# EAGLE design TCC (EAGLE 7.5.0)
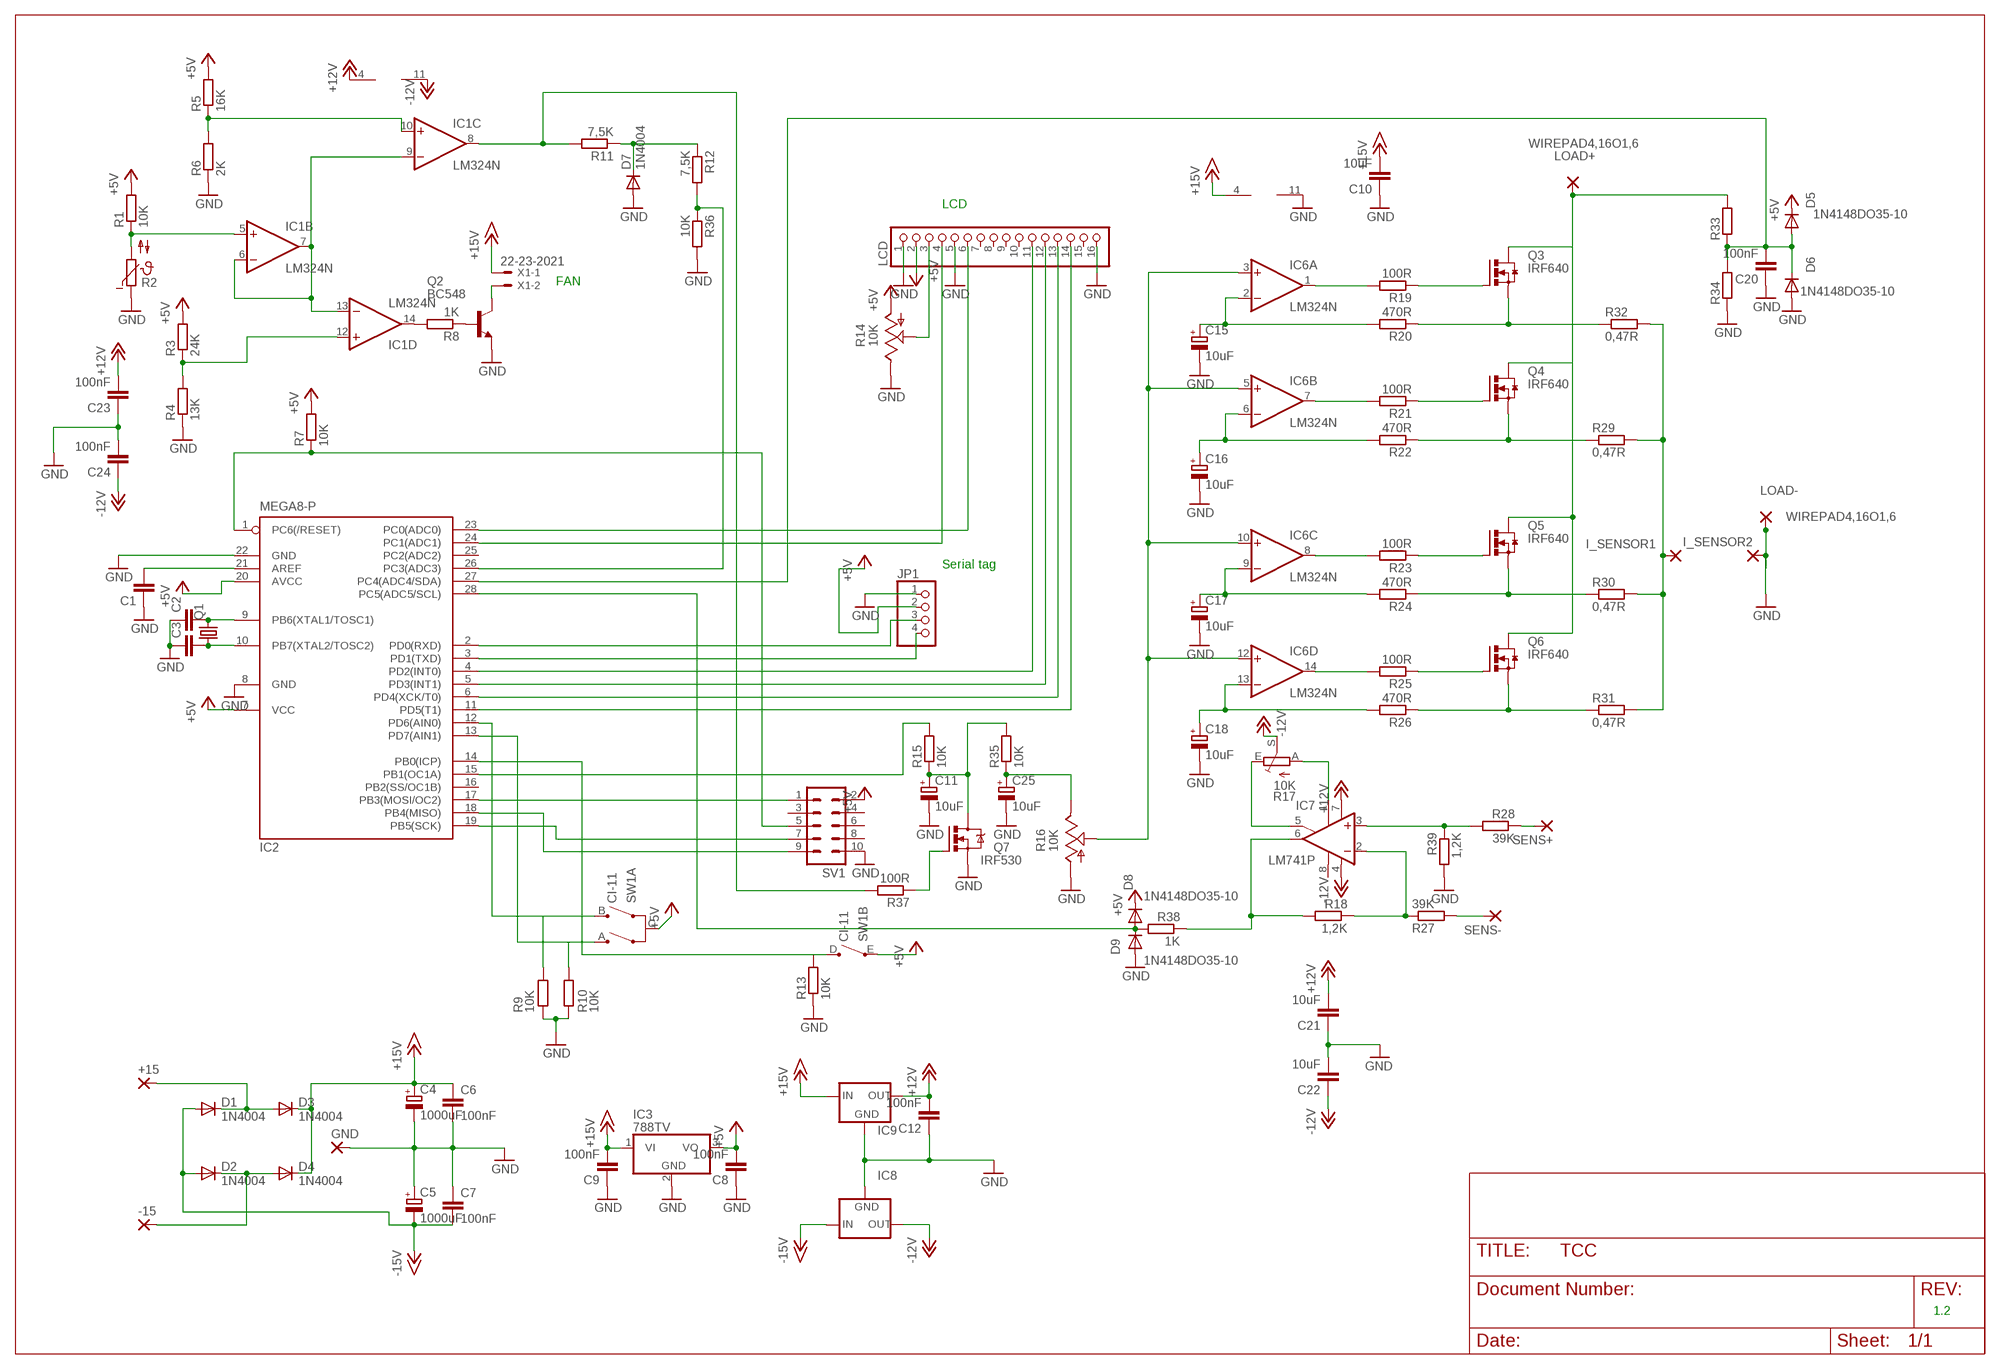
[diagram p0: schematic, sheet 1]

## Parts
+15  2,54/0,9  [2,54/0,9]
-15  2,54/0,9  [2,54/0,9]
C1  C5/2.5  [C5B2.5]
C2  C5/2.5  [C5B2.5]
C3  C5/2.5  [C5B2.5]
C4  1000uF  CPOL-EUE3.5-10  [E3,5-10]
C5  1000uF  CPOL-EUE3.5-10  [E3,5-10]
C6  100nF  C-EU050-025X075  [C050-025X075]
C7  100nF  C-EU050-025X075  [C050-025X075]
C8  100nF  C5/2.5  [C5B2.5]
C9  100nF  C5/2.5  [C5B2.5]
C10  10uF  C5/2.5  [C5B2.5]
C11  10uF  CPOL-EUE2,5-6E  [E2,5-6E]
C12  100nF  C5/2.5  [C5B2.5]
C15  10uF  CPOL-EUE2,5-6E  [E2,5-6E]
C16  10uF  CPOL-EUE2,5-6E  [E2,5-6E]
C17  10uF  CPOL-EUE2,5-6E  [E2,5-6E]
C18  10uF  CPOL-EUE2,5-6E  [E2,5-6E]
C20  100nF  C5/2.5  [C5B2.5]
C21  10uF  C5/2.5  [C5B2.5]
C22  10uF  C5/2.5  [C5B2.5]
C23  100nF  C5/2.5  [C5B2.5]
C24  100nF  C5/2.5  [C5B2.5]
C25  10uF  CPOL-EUE2,5-6E  [E2,5-6E]
D1  1N4004  [DO41-10]
D2  1N4004  [DO41-10]
D3  1N4004  [DO41-10]
D4  1N4004  [DO41-10]
D5  1N4148DO35-10  [DO35-10]
D6  1N4148DO35-10  [DO35-10]
D7  1N4004  [DO41-10]
D8  1N4148DO35-10  [DO35-10]
D9  1N4148DO35-10  [DO35-10]
GND  2,54/0,9  [2,54/0,9]
I_SENSOR1  3,17/1,3  [3,17/1,3]
I_SENSOR2  3,17/1,3  [3,17/1,3]
IC1  LM324N  [DIL14]
IC2  MEGA8-P  [DIL28-3]
IC3  788TV  [TO220V]
IC6  LM324N  [DIL14]
IC7  LM741P  [DIL08]
IC8  79XXS  [79XXS]
IC9  78XXS  [78XXS]
JP1  PINHD-1X4  [1X04]
LCD  PINHD-1X16  [1X16]
LOAD+  WIREPAD4,16O1,6  [4,16O1,6]
LOAD-  WIREPAD4,16O1,6  [4,16O1,6]
Q1  CRYSTALHC49S  [HC49/S]
Q2  BC548  [TO92-EBC]
Q3  IRF640  IRFI540NPBF  [TO220BH]
Q4  IRF640  IRFI540NPBF  [TO220BH]
Q5  IRF640  IRFI540NPBF  [TO220BH]
Q6  IRF640  IRFI540NPBF  [TO220BH]
Q7  IRF530  [TO220BV]
R1  10K  R-EU_0207/12  [0207/12]
R2  NTC640  [P640]
R3  24K  R-EU_0207/10  [0207/10]
R4  13K  R-EU_0204/7  [0204/7]
R5  16K  R-EU_0204/7  [0204/7]
R6  2K  R-EU_0204/7  [0204/7]
R7  10K  R-EU_0204/7  [0204/7]
R8  1K  R-EU_0204/7  [0204/7]
R9  10K  R-EU_0204/7  [0204/7]
R10  10K  R-EU_0204/7  [0204/7]
R11  7,5K  R-EU_0204/7  [0204/7]
R12  7,5K  R-EU_0204/7  [0204/7]
R13  10K  R-EU_0207/10  [0207/10]
R14  10K  TRIM_US-LI10  [LI10@1]
R15  10K  R-EU_0204/7  [0204/7]
R16  10K  TRIM_US-S64W  [S64W]
R17  10K  TRIM_EU-LI10  [LI10]
R18  1,2K  R-EU_0207/10  [0207/10]
R19  100R  R-EU_0207/10  [0207/10]
R20  470R  R-EU_0207/10  [0207/10]
R21  100R  R-EU_0207/15  [0207/15]
R22  470R  R-EU_0207/12  [0207/12]
R23  100R  R-EU_0207/15  [0207/15]
R24  470R  R-EU_0207/10  [0207/10]
R25  100R  R-EU_0207/10  [0207/10]
R26  470R  R-EU_0207/10  [0207/10]
R27  39K  R-EU_0207/10  [0207/10]
R28  39K  R-EU_0204/7  [0204/7]
R29  0,47R  R-EU_VTA56  [VTA56]
R30  0,47R  R-EU_VTA56  [VTA56]
R31  0,47R  R-EU_VTA56  [VTA56]
R32  0,47R  R-EU_VTA56  [VTA56]
R33  R-EU_0207/15  [0207/15]
R34  R-EU_0207/10  [0207/10]
R35  10K  R-EU_0204/7  [0204/7]
R36  10K  R-EU_0204/7  [0204/7]
R37  100R  R-EU_0204/7  [0204/7]
R38  1K  R-EU_0207/10  [0207/10]
R39  1,2K  R-EU_0207/10  [0207/10]
SENS+  2,54/1,1  [2,54/1,1]
SENS-  2,54/1,1  [2,54/1,1]
SV1  ML10  [ML10]
SW1  CI-11  [CI-11]
X1  22-23-2021  [22-23-2021]

## Nets
+5V: C8.2 D5.C D8.C IC2.7(VCC) IC2.20(AVCC) IC3.3(VO) JP1.2 LCD.2 R1.2 R3.2 R5.2 R7.2 R14.A SV1.2 SW1.C(A:C) SW1.E(B:E)
+12V: C12.2 C21.2 C23.2 IC1.4(P:V+) IC7.7(V+) IC9.OUT
+15V: C4.+ C6.1 C9.2 C10.2 D3.C D4.C IC3.1(VI) IC6.4(P:V+) IC9.IN X1.1
-12V: C22.1 C24.1 IC1.11(P:V-) IC7.4(V-) IC8.OUT R17.S
-15V: C5.- C7.2 D1.A D2.A IC8.IN
GND: C1.1 C2.1 C3.1 C4.- C5.+ C6.2 C7.1 C8.1 C9.1 C10.1 C11.- C12.1 C15.- C16.- C17.- C18.- C20.1 C21.1 C22.2 C23.1 C24.2 C25.- D6.A D7.A D9.A GND.1(P) I_SENSOR2.1(P) IC2.8(GND) IC2.22(GND) IC3.2(GND) IC6.11(P:V-) IC8.GND IC9.GND JP1.1 LCD.1 LCD.5 LCD.16 LOAD-.1(P) Q2.E Q7.S R2.1 R4.1 R6.1 R9.1 R10.1 R13.1 R14.E R16.A R34.1 R36.2 R39.2 SV1.10
N$1: C2.2 IC2.9(PB6(XTAL1/TOSC1)) Q1.2
N$2: C3.2 IC2.10(PB7(XTAL2/TOSC2)) Q1.1
N$3: IC2.17(PB3(MOSI/OC2)) SV1.1
N$4: IC2.18(PB4(MISO)) SV1.9
N$5: IC2.19(PB5(SCK)) SV1.7
N$6: IC2.1(PC6(/RESET)) R7.1 SV1.5
N$7: C1.2 IC2.21(AREF)
N$8: IC1.8(C:OUT) R11.2 R37.2
N$9: IC2.24(PC1(ADC1)) LCD.4
N$10: IC2.23(PC0(ADC0)) LCD.6
N$11: IC2.4(PD2(INT0)) LCD.11
N$12: IC2.5(PD3(INT1)) LCD.12
N$13: IC2.14(PB0(ICP)) R13.2 SW1.D(B:D)
N$14: IC2.11(PD5(T1)) LCD.14
N$15: IC2.12(PD6(AIN0)) R9.2 SW1.B(A:B)
N$16: C11.+ Q7.D R15.1 R35.2
N$17: Q3.S R20.1 R32.1
N$18: Q4.S R22.1 R29.1
N$19: Q5.S R24.1 R30.1
N$20: IC2.13(PD7(AIN1)) R10.2 SW1.A(A:A)
N$21: Q6.S R26.1 R31.1
N$22: IC6.1(A:OUT) R19.2
N$23: Q3.G R19.1
N$24: IC6.7(B:OUT) R21.2
N$25: Q4.G R21.1
N$26: LOAD+.1(P) Q3.D Q4.D Q5.D Q6.D R33.2
N$27: IC6.3(A:+IN) IC6.5(B:+IN) IC6.10(C:+IN) IC6.12(D:+IN) R16.S
N$28: C15.+ IC6.2(A:-IN) R20.2
N$29: C17.+ IC6.9(C:-IN) R24.2
N$30: C16.+ IC6.6(B:-IN) R22.2
N$31: IC7.2(-IN) R18.1 R27.1
N$32: IC1.6(B:-IN) IC1.7(B:OUT) IC1.9(C:-IN) IC1.13(D:-IN)
N$33: C18.+ IC6.13(D:-IN) R26.2
N$34: D8.A D9.C IC2.28(PC5(ADC5/SCL)) R38.2
N$35: IC7.1(ON1) R17.A
N$36: C25.+ R16.E R35.1
N$37: IC2.15(PB1(OC1A)) R15.2
N$38: IC7.5(ON2) R17.E
N$39: C20.2 D5.A D6.C IC2.27(PC4(ADC4/SDA)) R33.1 R34.2
N$40: LCD.3 R14.S
N$41: IC1.5(B:+IN) R1.1 R2.2
N$42: IC1.10(C:+IN) R5.1 R6.2
N$43: IC7.3(+IN) R28.2 R39.1
N$44: Q2.B R8.1
N$45: IC2.26(PC3(ADC3)) R12.2 R36.1
N$46: Q2.C X1.2
N$47: IC1.14(D:OUT) R8.2
N$48: IC1.12(D:+IN) R3.1 R4.2
N$49: I_SENSOR1.1(P) R29.2 R30.2 R31.2 R32.2
N$50: IC2.6(PD4(XCK/T0)) LCD.13
N$51: IC6.8(C:OUT) R23.2
N$52: Q5.G R23.1
N$53: IC6.14(D:OUT) R25.2
N$54: Q6.G R25.1
N$55: Q7.G R37.1
N$56: D7.C R11.1 R12.1
N$57: +15.1(P) D1.C D3.A
N$58: -15.1(P) D2.C D4.A
N$60: IC7.6(OUT) R18.2 R38.1
N$61: R27.2 SENS-.1(P)
N$62: R28.1 SENS+.1(P)
N$63: IC2.3(PD1(TXD)) JP1.4
N$64: IC2.2(PD0(RXD)) JP1.3
Unconnected: IC1.1(A:OUT) IC1.2(A:-IN) IC1.3(A:+IN) IC2.16(PB2(SS/OC1B)) IC2.25(PC2(ADC2)) IC7.8(OPT) LCD.7 LCD.8 LCD.9 LCD.10 LCD.15 SV1.3 SV1.4 SV1.6 SV1.8

## Notes on the sheet
- LCD
- FAN
- Serial tag
- 1.2

## Library data of the parts
+15 -15 GND = wirepad:2,54/0,9: THROUGH-HOLE PAD
C1-C3 C8-C10 C12 C20-C24 = capacitor-wima:C: CAPACITOR naming: grid - package width
C4 C5 C11 C15-C18 C25 = rcl:CPOL-EU: POLARIZED CAPACITOR, European symbol
C6 C7 = rcl:C-EU: CAPACITOR, European symbol
D1-D4 D7 = diode:1N4004: DIODE general purpose rectifier, 1 A
D5 D6 D8 D9 = diode:1N4148: DIODE high speed (Philips)
I_SENSOR1 I_SENSOR2 = wirepad:3,17/1,3: THROUGH-HOLE PAD
IC1 IC6 = linear:LM324: OP AMP
IC2 = atmel:MEGA8-P: MICROCONTROLLER 8 Kbytes FLASH, 1 kbytes SRAM, 512 bytes EEPROM, USART, 4-channel 10 bit ADC, 2-channel 8 bit ADC Pin compatible with Atmega48, ATMega88, ATMega168 Source: avr.lbr; OC_FARNELL: unknown; OC_NEWARK: unknown
IC3 = linear:78*: Positive VOLTAGE REGULATOR Source: http://cache.national.com/ds/LM/LM78L05.pdf http://www.fairchildsemi.com/ds/LM/LM7805.pdf
IC7 = linear:*741: OP AMP
IC8 = v-reg:79XXS: VOLTAGE REGULATOR
IC9 = v-reg:78XXS: VOLTAGE REGULATOR
JP1 = pinhead:PINHD-1X4: PIN HEADER
LCD = pinhead:PINHD-1X16: PIN HEADER
LOAD+ LOAD- = wirepad:WIREPAD: Wire PAD connect wire on PCB
Q1 = crystal:CRYSTAL: CRYSTAL; OC_FARNELL: 1667008; OC_NEWARK: unknown
Q2 = transistor-npn:BC548*: NPN Transistor
Q3-Q6 = transistor-power:IRFI540NPBF: HEXFET Power MOISFET VDSS = 100V, RDS(on) = 0.052 Ohm, ID = 20A, VGS(th) = 2.0 -- 4.0V Source: http://www.irf.com/product-info/datasheets/data/irfi540npbf.pdf
Q7 = transistor-power:IRF530: HEXFET Power MOSFET
R1 R3-R8 R11 R12 R15 R35-R37 = resistor:R-EU_: RESISTOR, European symbol
R2 = ptc-ntc:NTC640: PHILIPS NTC; OC_FARNELL: unknown; OC_NEWARK: unknown
R9 R10 R13 R18-R34 R38 R39 = rcl:R-EU_: RESISTOR, European symbol
R14 R16 = pot:TRIM_US-: POTENTIOMETER
R17 = pot:TRIM_EU-: POTENTIOMETER
SENS+ SENS- = wirepad:2,54/1,1: THROUGH-HOLE PAD
SV1 = con-harting-ml:ML10: HARTING; OC_FARNELL: unknown; OC_NEWARK: unknown
SW1 = piher:CI-11: 11mm Incemental Encoder Source: www.piher.net .. 04-CI-11v04.pdf; OC_FARNELL: unknown; OC_NEWARK: unknown
X1 = con-molex:22-23-2021: .100" (2.54mm) Center Header - 2 Pin; MF: MOLEX; MPN: 22-23-2021; OC_FARNELL: 1462926; OC_NEWARK: 25C3832

## Board
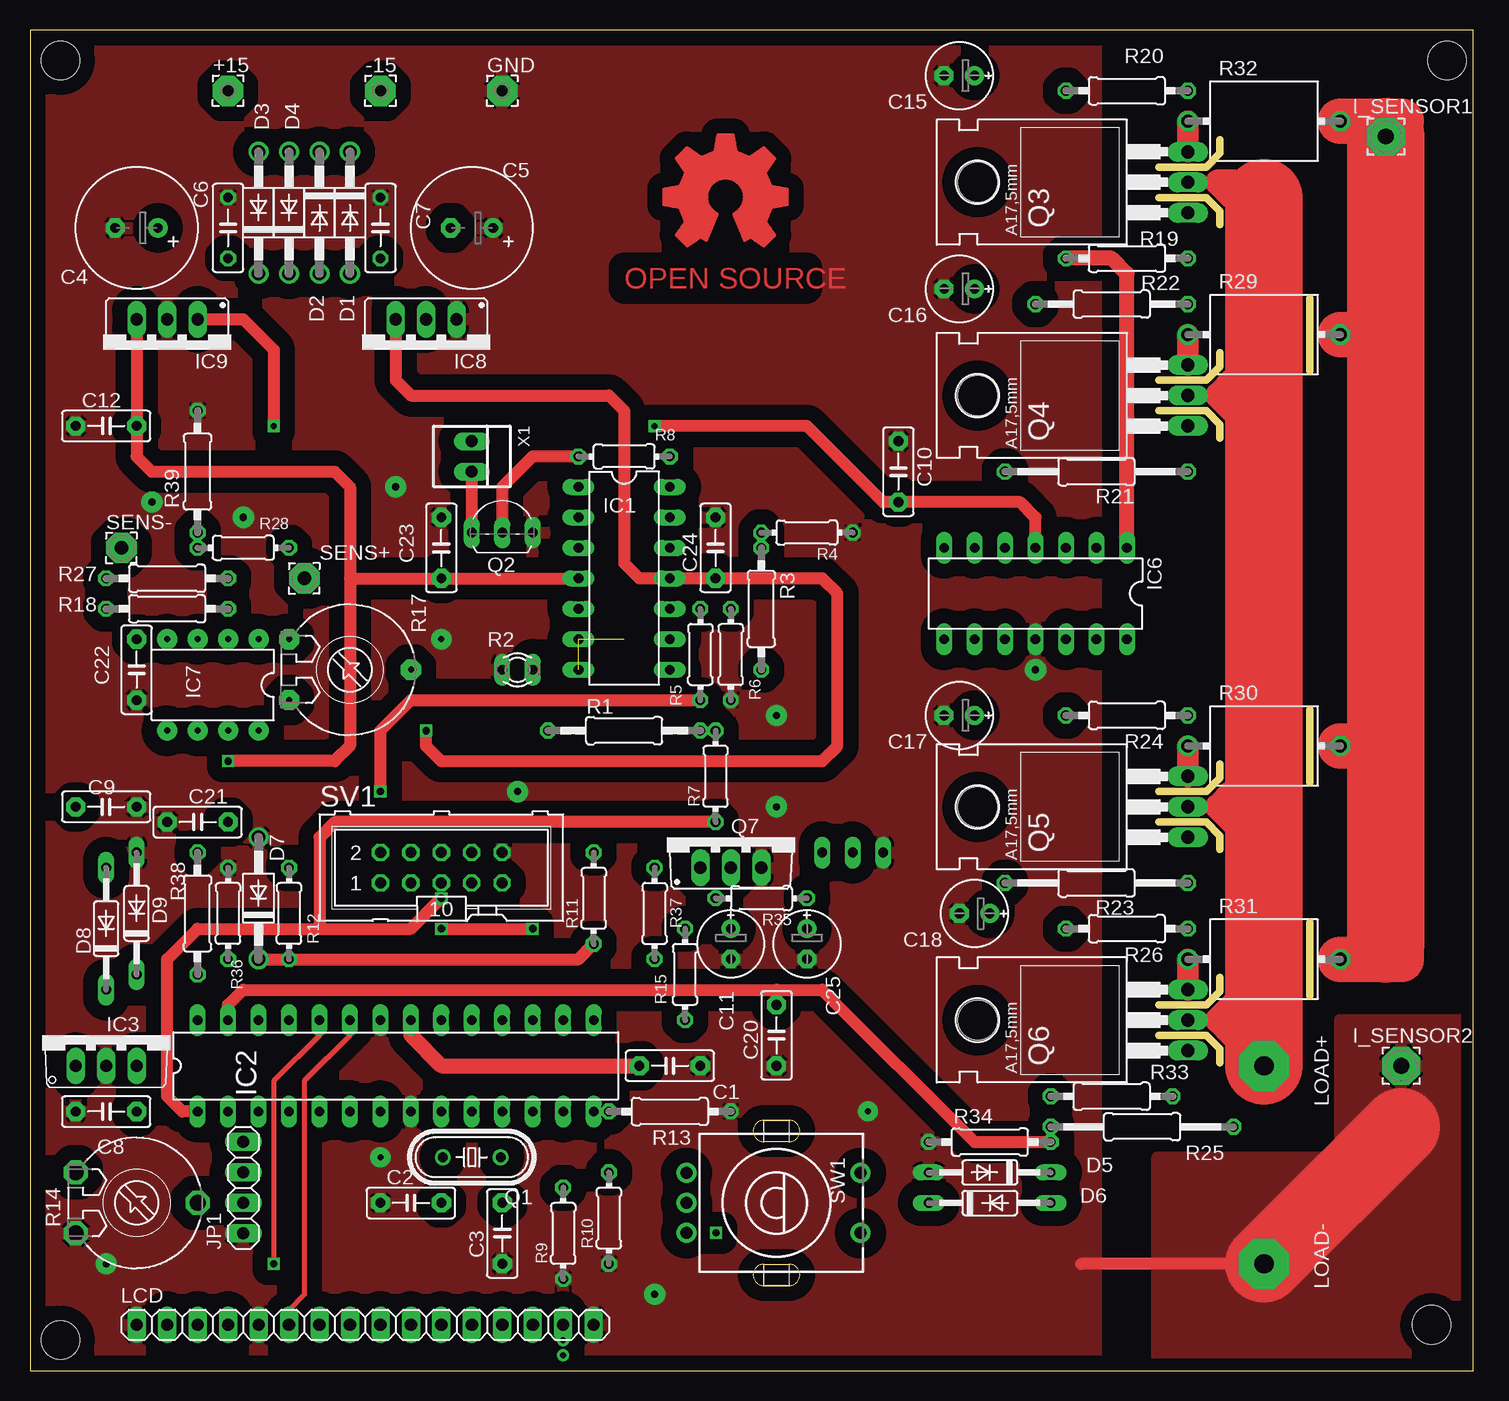
[diagram p1: board, top side]
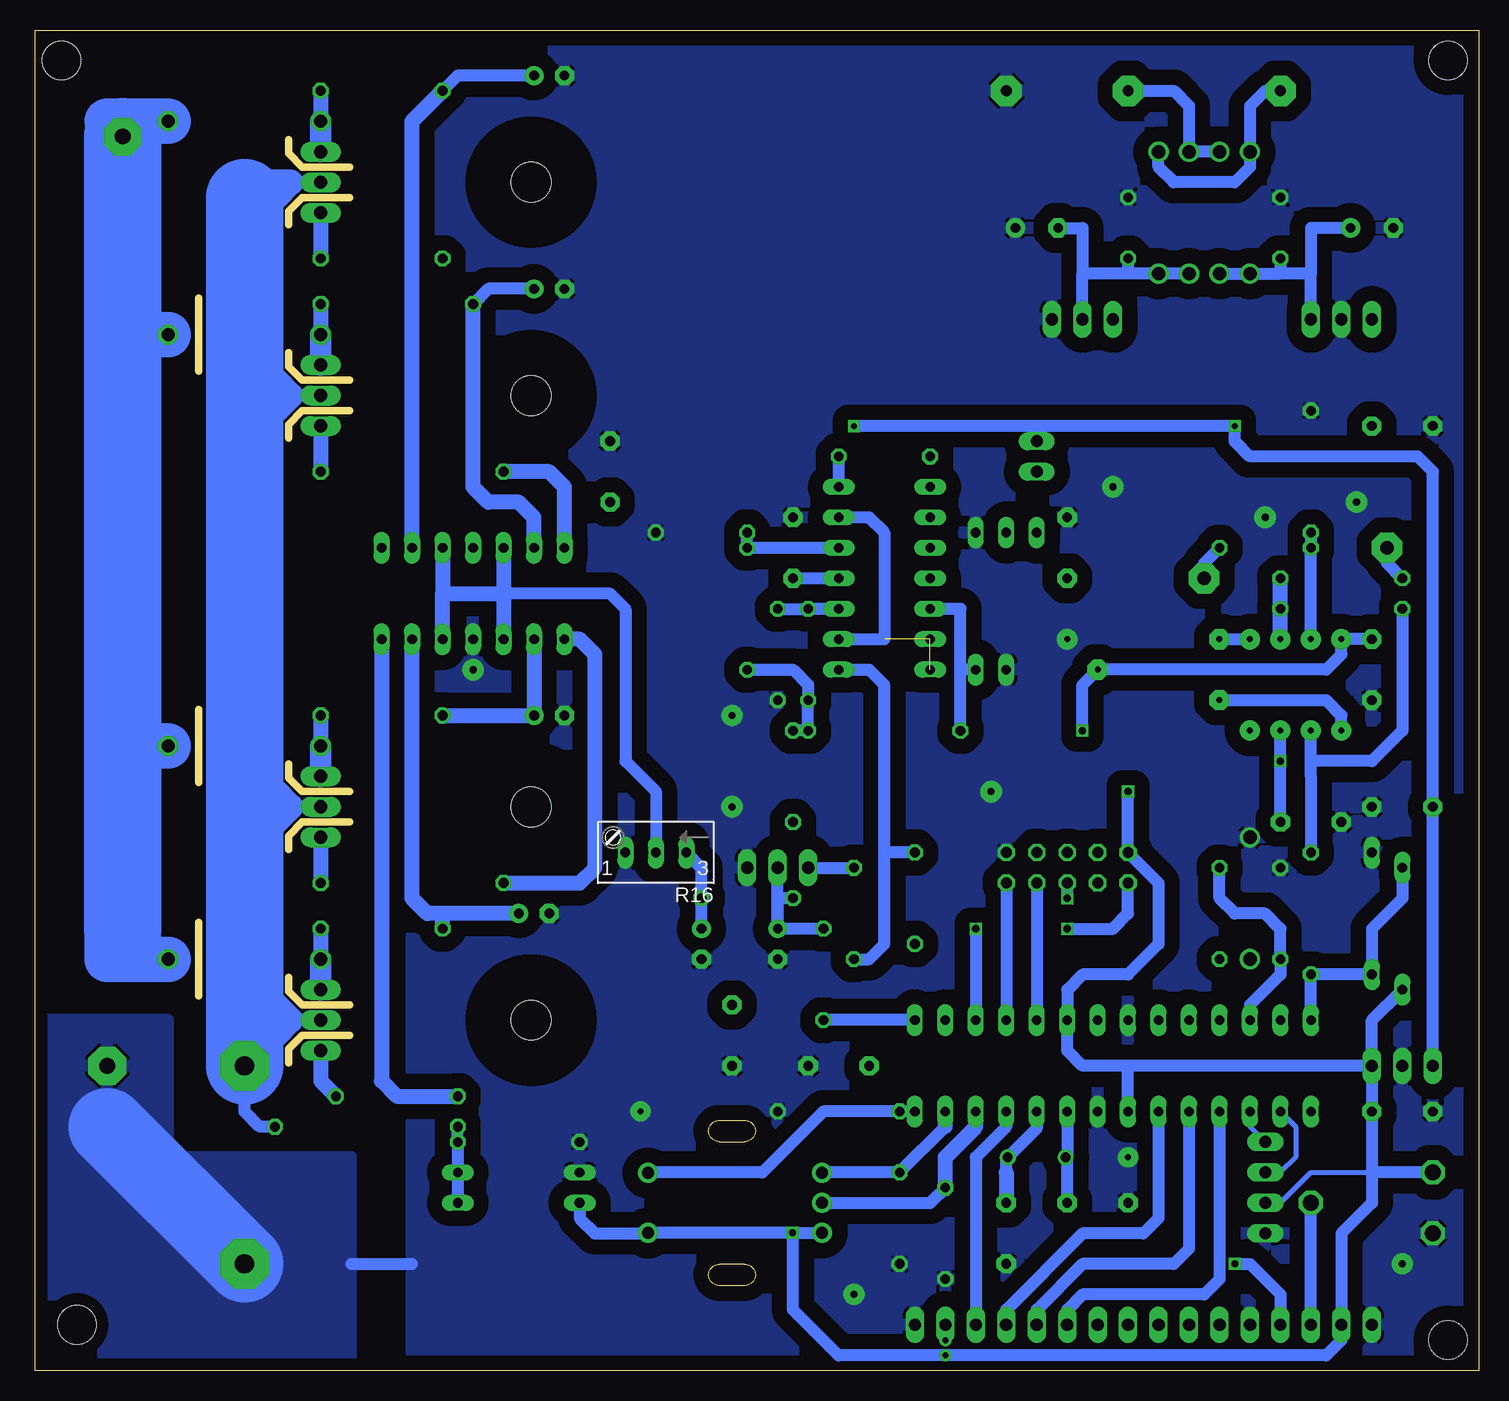
[diagram p2: board, bottom side, seen from below]

Size 120.32 x 111.75 mm. Coordinates in mm from the lower left corner, seen from the top.
Outline: 0,0 120.32,0 120.32,111.75 0,111.75 0,0
Copper layers (1*16): Top 0.035mm / dielectric 1.5mm / Bottom 0.035mm
Design rules "default": minimum track width 10mil, minimum drill 24mil, track to track 8mil, track to pad 8mil, pad to pad 8mil, via to via 8mil, smd to smd 8mil, copper to edge 40mil, drill to drill 8mil, minimum pad ring 10mil, minimum via ring 8mil, stop-mask expansion 4mil, vias tented up to drill 0mil, thermal gap 10mil
Holes 3.2 mm at 2.54,109.22 118.11,109.22 116.84,3.81 2.54,2.54
Milling: 27 lines

### Footprints (pad centres in the part's own frame; a part is rotated, then mirrored left to right if it is on the bottom)
2,54/0,9 = drill 0.914 pad 2.54 octagon: 1 0,0
C5B2.5 = drill 0.813 pad 1.6 octagon: 1 -2.54,0; 2 2.54,0
E3,5-10 = drill 0.813 pad 1.6: + -1.778,0 | drill 0.813 pad 1.6 octagon: - 1.778,0
C050-025X075 = drill 0.813 octagon: 1 -2.54,0; 2 2.54,0
E2,5-6E = drill 0.813 pad 1.575: + -1.27,0 | drill 0.813 pad 1.575 octagon: - 1.27,0
DO41-10 = drill 1.118: A 5.08,0; C -5.08,0
DO35-10 = drill 0.813 long: A 5.08,0; C -5.08,0
3,17/1,3 = drill 1.321 pad 3.175 octagon: 1 0,0
DIL14 = drill 0.813 long: 1 -7.62,-3.81; 2 -5.08,-3.81; 3 -2.54,-3.81; 4 0,-3.81; 5 2.54,-3.81; 6 5.08,-3.81; 7 7.62,-3.81; 8 7.62,3.81; 9 5.08,3.81; 10 2.54,3.81; 11 0,3.81; 12 -2.54,3.81; 13 -5.08,3.81; 14 -7.62,3.81
DIL28-3 = drill 0.813 long: 1 -16.51,-3.81; 2 -13.97,-3.81; 3 -11.43,-3.81; 4 -8.89,-3.81; 5 -6.35,-3.81; 6 -3.81,-3.81; 7 -1.27,-3.81; 8 1.27,-3.81; 9 3.81,-3.81; 10 6.35,-3.81; 11 8.89,-3.81; 12 11.43,-3.81; 13 13.97,-3.81; 14 16.51,-3.81; 15 16.51,3.81; 16 13.97,3.81; 17 11.43,3.81; 18 8.89,3.81; 19 6.35,3.81; 20 3.81,3.81; 21 1.27,3.81; 22 -1.27,3.81; 23 -3.81,3.81; 24 -6.35,3.81; 25 -8.89,3.81; 26 -11.43,3.81; 27 -13.97,3.81; 28 -16.51,3.81
TO220V = drill 1.016 long: 1 -2.54,-2.54; 2 0,-2.54; 3 2.54,-2.54
DIL08 = drill 0.5 pad 1.676: 1 -3.81,-3.81; 2 -1.27,-3.81; 3 1.27,-3.81; 4 3.81,-3.81; 5 3.81,3.81; 6 1.27,3.81; 7 -1.27,3.81; 8 -3.81,3.81
79XXS = drill 1.016 long: GND -2.54,-2.54; IN 0,-2.54; OUT 2.54,-2.54
78XXS = drill 1.016 long: GND 0,-2.54; IN -2.54,-2.54; OUT 2.54,-2.54
1X04 = drill 1.016 long: 1 -3.81,0; 2 -1.27,0; 3 1.27,0; 4 3.81,0
1X16 = drill 1.016 long: 1 -19.05,0; 2 -16.51,0; 3 -13.97,0; 4 -11.43,0; 5 -8.89,0; 6 -6.35,0; 7 -3.81,0; 8 -1.27,0; 9 1.27,0; 10 3.81,0; 11 6.35,0; 12 8.89,0; 13 11.43,0; 14 13.97,0; 15 16.51,0; 16 19.05,0
4,16O1,6 = drill 1.6 pad 4.166 octagon: 1 0,0
HC49/S = drill 0.813: 1 -2.413,0; 2 2.413,0
TO92-EBC = drill 0.813 long: B 0,-1.27; C -2.54,-1.27; E 2.54,-1.27
TO220BH = drill 1.118 long: D 0,-6.35; G -2.54,-6.35; S 2.54,-6.35 | hole 3.302: 0,11.176
TO220BV = drill 1.016 long: D 0,-2.54; G -2.54,-2.54; S 2.54,-2.54
0207/12 = drill 0.813 octagon: 1 -6.35,0; 2 6.35,0
P640 = drill 0.813 long: 1 -1.27,0; 2 1.27,0
0207/10 = drill 0.813 octagon: 1 -5.08,0; 2 5.08,0
0204/7 = drill 0.813 octagon: 1 -3.81,0; 2 3.81,0
LI10@1 = drill 1.321 octagon: A -2.54,-5.08; E 2.54,-5.08; S 0,5.08
S64W = drill 0.813 long: A 2.54,1.27; E -2.54,1.27; S 0,1.27
LI10 = drill 0.5 pad 1.676 octagon: A -2.54,-5.08; E 2.54,-5.08; S 0,5.08
0207/15 = drill 0.813 octagon: 1 -7.62,0; 2 7.62,0
VTA56 = drill 1.1 octagon: 1 -6.35,0; 2 6.35,0
2,54/1,1 = drill 1.118 pad 2.54 octagon: 1 0,0
ML10 = drill 0.914 octagon: 1 -5.08,-1.27; 2 -5.08,1.27; 3 -2.54,-1.27; 4 -2.54,1.27; 5 0,-1.27; 6 0,1.27; 7 2.54,-1.27; 8 2.54,1.27; 9 5.08,-1.27; 10 5.08,1.27
CI-11 = drill 1 pad 1.676: A -2.5,-7.5; B 0,-7.5; C 2.5,-7.5; D -2.5,7; E 2.5,7
22-23-2021 = drill 1 long: 1 -1.27,0; 2 1.27,0

### Placement (x,y rotation side)
+15  16.51,106.68 0 top
-15  29.21,106.68 0 top
C1  53.34,25.4 180 top
C2  31.75,13.97 0 top
C3  39.37,11.43 90 top
C4  8.89,95.25 180 top
C5  36.83,95.25 180 top
C6  16.51,95.25 90 top
C7  29.21,95.25 270 top
C8  6.35,21.59 0 top
C9  6.35,46.99 180 top
C10  72.39,74.93 270 top
C11  58.42,35.56 270 top
C12  6.35,78.74 0 top
C15  77.47,107.95 180 top
C16  77.47,90.17 180 top
C17  77.47,54.61 180 top
C18  78.74,38.1 180 top
C20  62.23,27.94 90 top
C21  13.97,45.72 0 top
C22  8.89,58.42 270 top
C23  34.29,68.58 270 top
C24  57.15,68.58 90 top
C25  64.77,35.56 270 top
D1  26.67,96.52 270 top
D2  24.13,96.52 270 top
D3  19.05,96.52 90 top
D4  21.59,96.52 90 top
D5  80.01,13.97 0 top
D6  80.01,16.51 180 top
D7  19.05,39.37 90 top
D8  6.35,36.83 90 top
D9  8.89,38.1 90 top
GND  39.37,106.68 0 top
I_SENSOR1  113.03,102.87 0 top
I_SENSOR2  114.3,25.4 0 top
IC1  49.53,66.04 270 top
IC2  30.48,25.4 0 top
IC3  6.35,27.94 0 top
IC6  83.82,64.77 180 top
IC7  15.24,57.15 180 top
IC8  33.02,85.09 180 top
IC9  11.43,85.09 180 top
JP1  17.78,15.24 90 top
LCD  27.94,3.81 0 top
LOAD+  102.87,25.4 90 top
LOAD-  102.87,8.89 90 top
Q1  36.83,17.78 180 top
Q2  39.37,71.12 0 top
Q3  90.17,99.06 90 top
Q4  90.17,81.28 90 top
Q5  90.17,46.99 90 top
Q6  90.17,29.21 90 top
Q7  58.42,44.45 0 top
R1  49.53,53.34 0 top
R2  40.64,58.42 0 top
R3  60.96,63.5 270 top
R4  64.77,69.85 180 top
R5  55.88,59.69 270 top
R6  58.42,59.69 90 top
R7  57.15,49.53 90 top
R8  49.53,76.2 0 top
R9  44.45,11.43 90 top
R10  48.26,12.7 90 top
R11  46.99,39.37 90 top
R12  21.59,38.1 90 top
R13  53.34,21.59 180 top
R14  8.89,13.97 270 top
R15  54.61,33.02 270 top
R16  68.58,44.45 180 bottom
R17  26.67,58.42 270 top
R18  11.43,63.5 180 top
R19  91.44,92.71 180 top
R20  91.44,106.68 180 top
R21  88.9,74.93 180 top
R22  90.17,88.9 180 top
R23  88.9,40.64 180 top
R24  91.44,54.61 180 top
R25  90.17,22.86 180 top
R26  91.44,36.83 180 top
R27  11.43,66.04 180 top
R28  17.78,68.58 180 top
R29  102.87,86.36 0 top
R30  102.87,52.07 0 top
R31  102.87,34.29 0 top
R32  102.87,104.14 0 top
R33  92.71,20.32 0 top
R34  80.01,19.05 0 top
R35  60.96,39.37 180 top
R36  16.51,38.1 90 top
R37  52.07,38.1 270 top
R38  13.97,38.1 270 top
R39  13.97,74.93 90 top
SENS+  22.86,66.04 0 top
SENS-  7.62,68.58 0 top
SV1  34.29,41.91 0 top
SW1  62.23,13.97 270 top
X1  36.83,76.2 270 top

### Tracks (layer width: path | path; a pad name or v marks a point on that pad's centre or on a via)
+5V  (via drill 0.5 pad 1.02, 0.6)
  Top 1.016: R5.2 31.75,55.88 29.21,53.34 v29.21,48.26
  Bottom 0.406: JP1.2 16.51,13.97 13.97,16.51 8.89,16.51
  Bottom 1.016: IC3.3 29.21,25.4 | 29.21,25.4 33.02,25.4 34.29,26.67 IC2.20 34.29,31.75 33.02,33.02 29.21,33.02 26.67,35.56 26.67,40.64 SV1.2 v29.21,48.26 | IC2.7 29.21,25.4 | IC3.3 C8.2 8.89,16.51 | R3.2 57.15,58.42 55.88,57.15 R5.2 R1.2 R7.2 | v57.19,11.47 57.15,11.43 57.15,5.08 53.34,1.27 v44.45,1.27 12.7,1.27 11.43,2.54 LCD.2 | LCD.2 11.43,11.43 8.89,13.97 8.89,16.51 | 11.43,2.79 LCD.2 | IC3.3 8.89,29.21 D8.C | v57.19,11.47 SW1.C | v57.19,11.47 SW1.E 69.27,11.43 73.66,11.43 74.93,12.7 D5.C | R14.A 8.89,16.51
+12V  (via drill 0.6)
  Top 1.016: IC1.4 C23.2 26.67,66.04 | IC9.OUT C12.2 8.89,76.2 10.16,74.93 25.4,74.93 26.67,73.66 26.67,66.04 | 26.67,66.04 26.67,52.07 25.4,50.8 v16.51,50.8
  Bottom 1.016: C21.2 v16.51,50.8 IC7.7
+15V  (via drill 0.5 pad 1.02)
  Top 1.016: IC9.IN 17.78,87.63 20.32,85.09 v20.32,78.74 | IC6.4 83.82,71.12 82.55,72.39 C10.2 71.12,72.39 64.77,78.74 v52.07,78.74
  Bottom 1.016: D4.C D3.C 16.51,91.44 | C6.1 16.51,91.44 | IC9.IN 13.97,91.44 | C4.+ 13.97,95.25 13.97,91.44 | IC3.1 C9.2 3.81,74.93 5.08,76.2 19.05,76.2 20.32,77.47 v20.32,78.74 36.83,78.74 | 36.83,78.74 v52.07,78.74 | X1.1 36.83,78.74 | 13.97,91.44 16.51,91.44
-12V  (via drill 0.6)
  Top 1.016: IC8.OUT 30.48,82.55 31.75,81.28 48.26,81.28 49.53,80.01 49.53,67.31 50.8,66.04 IC1.11 66.04,66.04 67.31,64.77 67.31,52.07 66.04,50.8 34.29,50.8 33.02,52.07 v33.02,53.34
  Bottom 1.016: IC1.11 C24.1 | C22.1 IC7.4 11.43,59.69 12.7,58.42 R17.S 33.02,57.15 v33.02,53.34
-15V
  Bottom 1.016: D2.A D1.A 29.21,91.44 | 29.21,91.44 33.02,91.44 | C7.2 29.21,91.44 | IC8.IN 33.02,91.44 | 33.02,91.44 33.02,95.25 C5.-
GND  (via drill 0.5 pad 1.68, 0.6 pad 1.78)
  Top 1.016: LOAD-.1 87.63,8.89
  Top 6.452: LOAD-.1 114.3,20.32
  Bottom 1.016: 93.98,8.89 88.9,8.89
  Bottom 6.452: 114.3,20.32 LOAD-.1
  other vias: 30.48,73.66 10.16,72.39 83.82,58.42 17.78,71.12 6.35,8.89 40.64,48.26 52.07,6.35 62.23,54.61 62.23,46.99 34.29,60.96 29.21,17.78 69.85,21.59
  pour Top (isolate 1.27): 0,116.84 0,0 88.9,0 88.9,116.84
  pour Bottom (isolate 1.27): 0,116.84 0,0 88.9,0 88.9,116.84
  pour Top (isolate 1.016): 120.65,29.21 120.65,0 93.98,0 93.98,17.78 109.22,17.78 109.22,29.21
  pour Bottom (isolate 1.016): 120.65,29.21 120.65,0 93.98,0 93.98,17.78 109.22,17.78 109.22,29.21
N$1
  Bottom 1.016: IC2.9 34.29,17.91 Q1.2 34.29,17.65 C2.2
N$2
  Bottom 1.016: IC2.10 36.83,20.19 Q1.1 39.37,17.65 39.37,16.51
  Bottom 1.27: 39.37,16.51 C3.2
N$3  (via drill 0.6)
  Top 1.016: v34.29,36.83 v41.91,36.83
  Bottom 1.016: v41.91,36.83 IC2.17 | v34.29,36.83 30.48,36.83 29.21,38.1 SV1.1
N$4
  Bottom 1.016: SV1.9 IC2.18
N$5
  Bottom 1.016: SV1.7 IC2.19
N$6  (via drill 0.6)
  Top 1.016: IC2.1 12.7,21.59 11.43,22.86 11.43,34.29 13.97,36.83 24.13,36.83 | R7.1 25.4,45.72 24.13,44.45 24.13,36.83 | 24.13,36.83 31.75,36.83 v34.29,39.37
  Bottom 1.016: v34.29,39.37 SV1.5
N$7
  Top 1.27: IC2.21 31.75,27.94 34.29,25.4 C1.2
N$8
  Bottom 1.016: IC1.8 50.8,58.42 49.53,57.15 49.53,43.18 | 49.53,43.18 49.53,35.56 50.8,34.29 R37.2 | R11.2 49.53,43.18
N$9  (via drill 0.6)
  Top 0.406: IC2.24 24.13,27.94 20.32,24.13 v20.32,8.89
  Bottom 1.016: v20.32,8.89 19.05,8.89 16.51,6.35 LCD.4
N$10
  Top 0.406: IC2.23 26.67,27.94 22.86,24.13 22.86,6.35 21.59,5.08 LCD.6
N$11
  Bottom 1.016: IC2.4 21.59,7.62 22.86,6.35 33.02,6.35 34.29,5.08 LCD.11
N$12
  Bottom 1.016: IC2.5 24.13,10.16 25.4,8.89 33.02,8.89 36.83,5.08 LCD.12
N$13
  Bottom 1.016: IC2.14 R13.2 54.61,21.59 59.69,16.51 69.19,16.51 SW1.D
N$14
  Bottom 1.016: IC2.11 39.37,20.32 41.91,17.78 LCD.14
N$15
  Bottom 1.016: SW1.B 45.72,13.97 R9.2
  Bottom 1.27: R9.2 44.45,17.78 41.91,20.32 IC2.12
N$16
  Bottom 1.016: R15.1 C11.+ | C11.+ Q7.D | R35.2 58.42,39.37 C11.+
N$17
  Top 1.778: Q3.S R32.1
  Bottom 1.27: R20.1 R32.1
  Bottom 1.778: Q3.S R32.1
N$18
  Top 1.778: Q4.S R29.1
  Bottom 1.27: R22.1 R29.1
  Bottom 1.778: Q4.S R29.1
N$19
  Top 1.778: Q5.S R30.1
  Bottom 1.27: R24.1 R30.1
  Bottom 1.778: Q5.S R30.1
N$20
  Bottom 1.016: 44.45,20.32 R10.2 54.69,16.51 SW1.A
  Bottom 1.27: 44.45,20.32 IC2.13
N$21
  Top 1.778: Q6.S R31.1
  Bottom 1.27: R26.1 R31.1
  Bottom 1.778: Q6.S R31.1
N$22
  Top 1.27: IC6.1 91.44,91.44 90.17,92.71 R19.2
N$23
  Bottom 1.27: Q3.G R19.1
N$24
  Bottom 1.27: IC6.7 76.2,73.66 77.47,74.93 R21.2
N$25
  Bottom 1.27: Q4.G R21.1
N$26
  Top 1.016: Q3.D 99.06,99.06 | Q4.D 99.06,81.28 | Q5.D 99.06,46.99 | Q6.D 99.06,29.21
  Top 2.184: 99.06,29.21 100.33,29.21 100.33,30.48 99.06,29.21 | 99.06,29.21 100.33,27.94 | 99.06,46.99 100.33,46.99 100.33,48.26 99.06,46.99 | 99.06,46.99 100.33,45.72 | 99.06,81.28 100.33,81.28 100.33,82.55 99.06,81.28 | 99.06,81.28 100.33,80.01 | 99.06,99.06 100.33,99.06 100.33,97.79 99.06,99.06
  Top 6.452: 102.87,97.79 LOAD+.1
  Bottom 1.016: 101.6,25.4 LOAD+.1 102.87,21.59 101.6,20.32 R33.2 | Q3.D 99.06,99.06 | Q4.D 99.06,81.28 | Q5.D 99.06,46.99 | Q6.D 99.06,29.21
  Bottom 2.184: 102.87,97.79 100.33,97.79 99.06,99.06 101.6,99.06 | 99.06,81.28 101.6,81.28 102.87,82.55 | 99.06,46.99 102.87,46.99 | 99.06,29.21 102.87,29.21 | 99.06,81.28 100.33,82.55 100.33,80.01 99.06,81.28 | 99.06,46.99 100.33,48.26 100.33,45.72 99.06,46.99 | 99.06,29.21 100.33,30.48 100.33,27.94 99.06,29.21
  Bottom 6.452: LOAD+.1 102.87,29.21 102.87,46.99 102.87,82.55 102.87,97.79
N$27
  Bottom 1.016: 82.55,64.77 72.39,64.77 71.12,63.5 71.12,50.8 68.58,48.26 R16.S
  Bottom 1.27: IC6.5 81.28,64.77 | 81.28,64.77 IC6.10 | IC6.3 86.36,64.77 | IC6.12 86.36,64.77 | 86.36,64.77 82.55,64.77 81.28,64.77
N$28
  Bottom 1.016: C15.+ 85.09,107.95 R20.2
  Bottom 1.27: IC6.2 88.9,104.14 R20.2
N$29
  Bottom 1.27: R24.2 C17.+ IC6.9
N$30
  Bottom 1.016: C16.+ 82.55,90.17 R22.2
  Bottom 1.27: IC6.6 78.74,71.12 80.01,72.39 82.55,72.39 83.82,73.66 R22.2
N$31
  Bottom 1.27: IC7.2 R18.1 R27.1
N$32  (2 unrouted)
  Bottom 1.016: IC1.9 49.53,60.96 49.53,69.85 50.8,71.12 IC1.13
N$33
  Bottom 1.27: C18.+ 86.36,38.1 | 86.36,38.1 87.63,38.1 88.9,39.37 IC6.13 | R26.2 86.36,38.1
N$34
  Bottom 1.016: IC2.28 R38.2 D9.C 8.89,36.83 6.35,39.37 D8.A
N$35
  Bottom 1.016: R17.A IC7.1
N$36
  Bottom 1.016: C25.+ R35.1 64.77,41.91 R16.E
N$37
  Bottom 1.016: IC2.15 R15.2
N$38
  Bottom 1.016: IC7.5 11.43,54.61 12.7,55.88 R17.E
N$39
  Top 1.016: IC2.27 16.51,30.48 17.78,31.75 62.23,31.75 | 62.23,31.75 66.04,31.75 78.74,19.05 R34.2 | C20.2 62.23,31.75
  Bottom 1.016: R33.1 R34.2 D6.C D5.A
N$40
  Bottom 1.016: LCD.3 R14.S
N$41
  Bottom 1.016: R2.2 43.18,58.42 | 43.18,58.42 43.18,63.5 IC1.5 | R1.1 43.18,58.42
N$42
  Bottom 1.016: IC1.10 R5.1 R6.2
N$43
  Bottom 1.016: IC7.3 R28.2 R39.1
N$44
  Top 1.016: R8.1 41.91,76.2 39.37,73.66 Q2.B
N$45
  Bottom 1.016: IC2.26 19.05,30.48 16.51,33.02 R36.1 16.51,36.83 17.78,38.1 20.32,38.1 21.59,39.37 R12.2
N$46
  Top 1.016: X1.2 Q2.C
N$47
  Bottom 1.016: R8.2 IC1.14
N$48
  Bottom 1.016: IC1.12 R3.1 R4.2
N$49
  Top 3.81: R32.2 114.3,104.14 I_SENSOR1.1 | 111.76,34.29 R31.2 114.3,34.29 114.3,38.1 | R30.2 111.76,52.07 | R29.2 110.49,86.36
  Top 6.452: I_SENSOR1.1 113.03,35.56
  Bottom 1.016: 114.3,34.29 113.03,35.56 | 111.76,35.56 113.03,35.56 | 114.3,40.64 114.3,50.8 113.03,52.07 | 113.03,35.56 113.03,50.8 111.76,52.07 | 113.03,100.33 113.03,87.63 111.76,86.36 110.49,86.36
  Bottom 3.81: R30.2 111.76,52.07 113.03,52.07 | 114.3,40.64 I_SENSOR1.1 | R31.2 114.3,34.29 114.3,36.83 | R29.2 110.49,86.36 | R32.2 114.3,104.14
  Bottom 6.452: I_SENSOR1.1 113.03,100.33 113.03,36.83
N$50
  Bottom 1.016: IC2.6 26.67,12.7 27.94,11.43 33.02,11.43 39.37,5.08 LCD.13
N$51
  Bottom 1.27: R23.2 74.93,40.64 73.66,41.91 73.66,59.69 74.93,60.96 IC6.8
N$52
  Bottom 1.27: Q5.G R23.1
N$53
  Bottom 1.27: IC6.14 91.44,24.13 90.17,22.86 R25.2
N$54
  Bottom 1.27: Q6.G 96.52,24.13 R25.1
N$55
  Bottom 1.016: Q7.G R37.1
N$56
  Top 1.016: R11.1 45.72,34.29 R12.1 D7.C
N$57
  Bottom 1.016: D1.C 26.67,100.33 25.4,99.06 20.32,99.06 19.05,100.33 D3.A 19.05,105.41 17.78,106.68 +15.1
N$58
  Bottom 1.016: D4.A D2.C 24.13,105.41 25.4,106.68 -15.1
N$59  (via drill 0.5 pad 1.02)
  Bottom 1.016: 44.45,3.81 v44.45,2.54
N$60
  Bottom 1.016: R38.1 13.97,49.53 13.97,50.8 | 13.97,50.8 IC7.6 | R18.2 6.35,53.34 8.89,50.8 13.97,50.8
N$61
  Bottom 1.016: R27.2 7.62,67.31 SENS-.1
N$62
  Bottom 1.016: R28.1 22.86,67.31 SENS+.1
N$63
  Bottom 0.406: JP1.4 19.05,20.32 IC2.3
N$64
  Bottom 0.406: IC2.2 15.24,20.32 15.24,17.78 16.51,16.51 JP1.3
(copper drawn outside any net)
  shapes: Top area x967

### Text on the board
Top: OPEN SOURCE